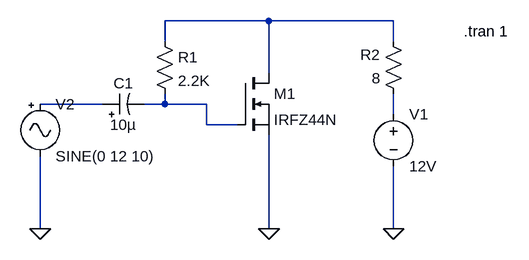
[diagram p0: schematic schematic.asc]
schematic.asc, the LTspice schematic file:
Version 4
SHEET 1 880 680
WIRE -96 -128 -256 -128
WIRE 96 -128 -96 -128
WIRE -256 -96 -256 -128
WIRE 96 -96 96 -128
WIRE -96 -48 -96 -128
WIRE -352 0 -448 0
WIRE -256 0 -256 -16
WIRE -256 0 -288 0
WIRE -192 0 -256 0
WIRE 96 16 96 -16
WIRE -192 32 -192 0
WIRE -144 32 -192 32
WIRE -448 192 -448 80
WIRE -96 192 -96 48
WIRE 96 192 96 96
FLAG -448 192 0
FLAG 96 192 0
FLAG -96 192 0
SYMBOL polcap -352 16 R270
WINDOW 0 32 32 VTop 2
WINDOW 3 0 32 VBottom 2
SYMATTR InstName C1
SYMATTR Value 10µ
SYMATTR Description Capacitor
SYMATTR Type cap
SYMATTR SpiceLine V=25 Irms=39m Rser=2.8 Lser=0
SYMBOL voltage 96 0 R0
WINDOW 123 0 0 Left 0
WINDOW 39 0 0 Left 0
SYMATTR InstName V1
SYMATTR Value 12V
SYMBOL Misc\\signal -448 -16 R0
WINDOW 123 0 0 Left 0
WINDOW 39 0 0 Left 0
SYMATTR InstName V2
SYMATTR Value SINE(0 12 10)
SYMBOL nmos -144 -48 R0
SYMATTR InstName M1
SYMATTR Value IRFZ44N
SYMBOL res -272 -112 R0
SYMATTR InstName R1
SYMATTR Value 2.2K
SYMBOL res 112 0 R180
WINDOW 0 36 76 Left 2
WINDOW 3 36 40 Left 2
SYMATTR InstName R2
SYMATTR Value 8
TEXT 204 -112 Left 2 !.tran 1

The netlist it stands for:
* schematic.asc
C1 N002 N003 10µ V=25 Irms=39m Rser=2.8 Lser=0
V1 N004 0 12V
V2 N002 0 SINE(0 12 10)
M1 N001 N003 0 0 IRFZ44N
R1 N001 N003 2.2K
R2 N004 N001 8
.model NMOS NMOS
.model PMOS PMOS
.lib standard.mos
.tran 1
.backanno
.end